# Altium schematic sheet Cell Monitor 8S RHS V0.1.SchDoc
size A4; SheetNumber: 5; SheetTotal: 9
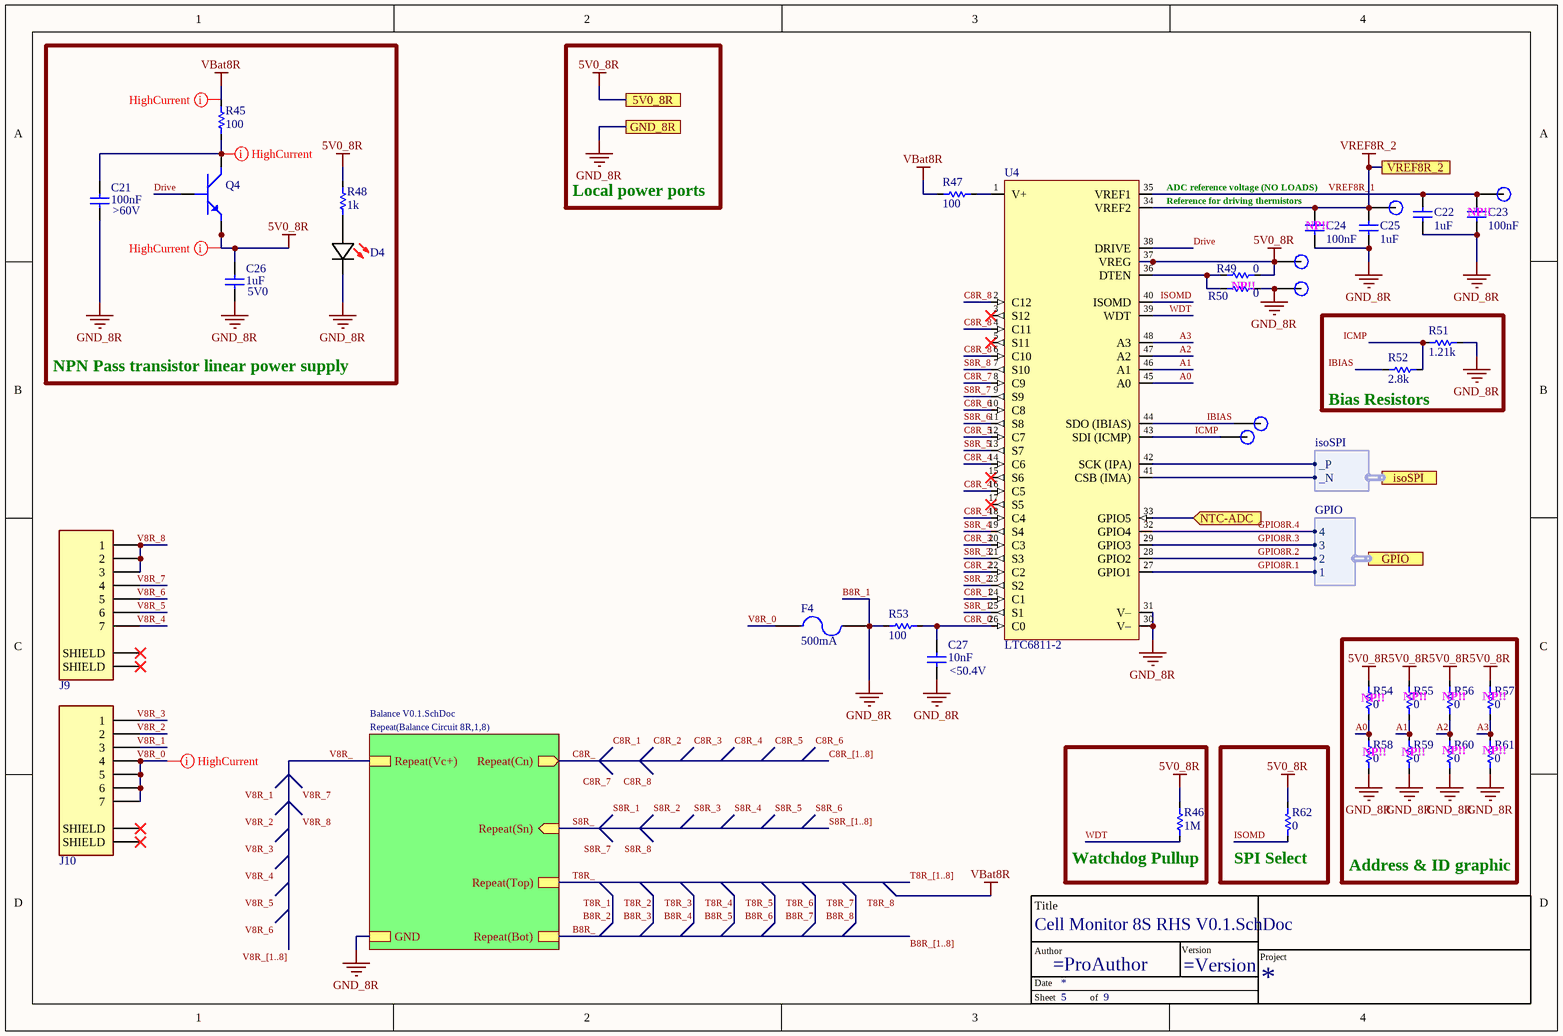
[diagram p0: Cell Monitor 8S RHS V0.1.SchDoc]

## Parts
*?  TitleBlock  (value not drawn)  (graphical)
C21  value 100nF  Voltage: >60V  [C_0402]  (hidden comment: GRM155R62A104KE14D)
C22  value 1uF  [C_0402]  (hidden comment: EMK105BJ105KV-F)
C23  value 100nF  [C_0402]  (hidden comment: GRM155R62A104KE14D)
C24  value 100nF  [C_0402]  (hidden comment: GRM155R62A104KE14D)
C25  value 1uF  [C_0402]  (hidden comment: EMK105BJ105KV-F)
C26  value 1uF  Voltage: 5V0  [C_0402]  (hidden comment: EMK105BJ105KV-F)
C27  value 10nF  Voltage: <50.4V  [C_0402]  (hidden comment: C1005X7S2A103K050BB)
D4  150060SS55040  [LED (0603)]  (value not drawn)
F4  Current Rating: 500mA  [0466.500NR]  (hidden comment: 0466.500NR)
J9  84953-7  [84953-7]  (value not drawn)
J10  84953-7  [84953-7]  (value not drawn)
NT5  NetTie  [NetTie]  (value not drawn)  (net tie, no BOM)
NT6  NetTie  [NetTie]  (value not drawn)  (net tie, no BOM)
Q4  PHPT60603NYX  [LFPAK56 (SOT669)]  (value not drawn)
R45  value 100  [R_2010]  (hidden comment: CRM2010-FX-1000ELF)
R46  value 1M  [R_0402]  (hidden comment: RC0402JR-071ML)
R47  value 100  [R_2010]  (hidden comment: CRM2010-FX-1000ELF)
R48  value 1k  [R_0402]  (hidden comment: RC0402FR-071KL)
R49  value 0  [R_0402]  (hidden comment: CR0402-J/-000GLF)
R50  value 0  [R_0402]  (hidden comment: CR0402-J/-000GLF)
R51  value 1.21k  [R_0402]  (hidden comment: CR0402-FX-1211GLF)
R52  value 2.8k  [R_0402]  (hidden comment: ERJ-2RKF2801X)
R53  value 100  [R_0402]  (hidden comment: RC0402FR-07100RL)
R54  value 0  [R_0402]  (hidden comment: CR0402-J/-000GLF)
R55  value 0  [R_0402]  (hidden comment: CR0402-J/-000GLF)
R56  value 0  [R_0402]  (hidden comment: CR0402-J/-000GLF)
R57  value 0  [R_0402]  (hidden comment: CR0402-J/-000GLF)
R58  value 0  [R_0402]  (hidden comment: CR0402-J/-000GLF)
R59  value 0  [R_0402]  (hidden comment: CR0402-J/-000GLF)
R60  value 0  [R_0402]  (hidden comment: CR0402-J/-000GLF)
R61  value 0  [R_0402]  (hidden comment: CR0402-J/-000GLF)
R62  value 0  [R_0402]  (hidden comment: CR0402-J/-000GLF)
TP15  VREF1  [Test Point]  (value not drawn)  (no BOM)
TP16  VREF2  [Test Point]  (value not drawn)  (no BOM)
TP17  5V0_8R  [Test Point]  (value not drawn)  (no BOM)
TP18  IBIAS  [Test Point]  (value not drawn)  (no BOM)
TP19  ICMP  [Test Point]  (value not drawn)  (no BOM)
TP20  5V0_8R  [Test Point]  (value not drawn)  (no BOM)
U4  LTC6811-2  [SSOP50P780X200-48N]

## Blocks framed on the sheet
NPN Pass transistor linear power supply: C21 C26 D4 Q4 R45 R48
Bias Resistors: R51 R52
Address & ID graphic: R54-R61
Watchdog Pullup: R46
SPI Select: R62

## Sub-sheets
Repeat(Balance Circuit 8R,1,8) = Balance V0.1.SchDoc: Repeat(Bot), Repeat(Vc+), Repeat(Top), Repeat(Cn) (out), Repeat(Sn) (in), GND

## Ports
5V0_8R, GND_8R, GPIO (harness GPIO), isoSPI (harness isoSPI), NTC-ADC (in), VREF8R_2

## Harnesses
GPIO: 1, 2, 3, 4
isoSPI: _P, _N

## Nets
5V0_8R: C26.2 Q4.1(Emitter) Q4.2(Emitter) Q4.3(Emitter) R46.2 R48.2 R49.2 R54.2 R55.2 R56.2 R57.2 R62.2 TP17.1 U4.37(VREG) ; port 5V0_8R
GND_8R: C21.1 C22.1 C23.1 C24.1 C25.1 C26.1 C27.1 D4.1(K) F4.2 NT5.1 R50.1 R51.2 R53.1 R58.1 R59.1 R60.1 R61.1 TP20.1 U4.30(V–) U4.31(V–) ; port GND_8R, sheet Repeat(Balance Circuit 8R,1,8)/GND
VBat8R: NT6.2 R45.2 R47.2
VREF8R_2: C24.2 C25.2 TP16.1 U4.34(VREF2) ; port VREF8R_2
A0: R54.1 R58.2 U4.45(A0)
A1: R55.1 R59.2 U4.46(A1)
A2: R56.1 R60.2 U4.47(A2)
A3: R57.1 R61.2 U4.48(A3)
B8R_: sheet Repeat(Balance Circuit 8R,1,8)/Repeat(Bot)
B8R_1: NT5.2
C8R_: sheet Repeat(Balance Circuit 8R,1,8)/Repeat(Cn)
C8R_0: C27.2 R53.2 U4.26(C0)
C8R_1: U4.24(C1)
C8R_2: U4.22(C2)
C8R_3: U4.20(C3)
C8R_4: U4.14(C6) U4.16(C5) U4.18(C4)
C8R_5: U4.12(C7)
C8R_6: U4.10(C8)
C8R_7: U4.8(C9)
C8R_8: U4.2(C12) U4.4(C11) U4.6(C10)
Drive: Q4.4(Base) U4.38(DRIVE)
GPIO8R.1: U4.27(GPIO1) ; port GPIO.1
GPIO8R.2: U4.28(GPIO2) ; port GPIO.2
GPIO8R.3: U4.29(GPIO3) ; port GPIO.3
GPIO8R.4: U4.32(GPIO4) ; port GPIO.4
IBIAS: R52.1 TP18.1 U4.44(SDO_(IBIAS))
ICMP: R51.1 R52.2 TP19.1 U4.43(SDI_(ICMP))
ISOMD: R62.1 U4.40(ISOMD)
NTC-ADC: U4.33(GPIO5) ; port NTC-ADC
S8R_: sheet Repeat(Balance Circuit 8R,1,8)/Repeat(Sn)
S8R_1: U4.25(S1)
S8R_2: U4.23(S2)
S8R_3: U4.21(S3)
S8R_4: U4.19(S4)
S8R_5: U4.13(S7)
S8R_6: U4.11(S8)
S8R_7: U4.9(S9)
S8R_8: U4.7(S10)
T8R_: sheet Repeat(Balance Circuit 8R,1,8)/Repeat(Top)
T8R_8: NT6.1
V8R_: sheet Repeat(Balance Circuit 8R,1,8)/Repeat(Vc+)
V8R_0: F4.1 J10.4 J10.5 J10.6 J10.7
V8R_1: J10.3
V8R_2: J10.2
V8R_3: J10.1
V8R_4: J9.7
V8R_5: J9.6
V8R_6: J9.5
V8R_7: J9.4
V8R_8: J9.1 J9.2 J9.3
VREF8R_1: C22.2 C23.2 TP15.1 U4.35(VREF1)
WDT: R46.1 U4.39(WDT)
NetC21_2: C21.2 Q4.5(Collector) R45.1
NetD4_2: D4.2(A) R48.1
NetR47_1: R47.1 U4.1(V+)
NetR49_1: R49.1 R50.2 U4.36(DTEN)
NetU4_41: U4.41(CSB_(IMA)) ; port isoSPI._N
NetU4_42: U4.42(SCK_(IPA)) ; port isoSPI._P

Not connected (* = marked no-connect by the designer): J9 S1(SHIELD)* S2(SHIELD)*; J10 S1(SHIELD)* S2(SHIELD)*; U4 3(S12)* 5(S11)* 15(S6)* 17(S5)*

## Buses and harness runs
bus B8R_[1..8]
bus C8R_[1..8]
bus S8R_[1..8]
bus T8R_[1..8]
bus V8R_[1..8]

## Layout directives
net class HighCurrent; Current: >50mA: 5V0_8R, NetC21_2, V8R_0, VBat8R

## Notes on the sheet
- Local power ports
- ADC reference voltage (NO LOADS)
- (near C24) Reference for driving thermistors
- (near C24) NP!!
- (near C23) NP!!
- (near R50) NP!!
- (near R54) NP!!
- (near R55) NP!!
- (near R56) NP!!
- (near R57) NP!!
- (near R58) NP!!
- (near R59) NP!!
- (near R60) NP!!
- (near R61) NP!!
- Labels drawn without touching a wire or pin: C8R_1, C8R_2, C8R_3, C8R_4, C8R_5, C8R_6, C8R_7, C8R_8, S8R_1, S8R_2, S8R_3, S8R_4, S8R_5, S8R_6, S8R_7, S8R_8, V8R_1, V8R_2, V8R_3, V8R_4, V8R_5, V8R_6, V8R_7, V8R_8
- (in symbol TitleBlock) Title; Author; Version; Project; Date; Sheet; of

## Library data of the parts
C21-C27 = Capacitor: ComponentLink1Description: New link; ComponentLink1URL: *
  C21 C23 C24: Manufacture Part Number 1: GRM155R62A104KE14D
D4 = 150060SS55040: LED RED DIFFUSED 0603 SMD; Manufacturer: Wurth Electronics; Lens Style: Flat; Luminous Intensity: 70mcd; Forward Voltage: 2V; Test Current: 20mA; Viewing Angle: 140°; Dominant Wavelength: 630nm; Lens Size: 0.8mm; Supplier 1: Mouser; Manufacturer Part Number: 150060SS55040; RoHS: No; Category: LEDs; Stock 1: 17006; Pricing 1: 1=0.18000, 10=0.16800, 50=0.16800, 100=0.15200, 1000=0.12100, 10000=0.10600 (USD); Mount: Surface Mount; Case/Package: 0603; Color: Red; Case Code (Imperial): 0603; Case Code (Metric): 1608; Packaging: Tape and Reel; Lens Transparency: Diffused; Length: 1.6mm; Width: 0.8mm; Height: 0.5mm; RoHS Compliant: No; Supplier Part Number 1: 710-150060SS55040
F4 = Fuse 2: LITTELFUSE - 0466.500NR - Fuse, Surface Mount, 500 mA, 466 Series, 63 VAC, 63 VDC, Very Fast Acting, 1206; Body Material: Thermoplastic; Voltage Rating (AC): 63V; Resistance: 350mR; DC Cold Resistance: 248mR; Fuse Type: Board Mount (Cartridge Style Excluded); Approvals: UL,CSA; Published: 8-Jun-2000; LatestRevisionDate: 17-Jul-2002; LatestRevisionNote: Re-released for DXP Platform.; PackageReference: PIN-W2/E2.8; Publisher: Altium Limited; PackageDescription: Thru-Hole; 2 Leads; Supplier 1: Mouser; Supplier Part Number 1: 576-0466.500NR; Manufacturer: Littelfuse; Manufacturer Part Number: 0466.500NR; RoHS: Yes; Category: Fuses; Stock 1: 36497; Pricing 1: 1=0.77000, 10=0.59200, 50=0.59200, 100=0.48900, 1000=0.41600, 10000=0.39000 (USD); Mount: Surface Mount; Case/Package: 1206; Number of Pins: 2; Case Code (Metric): 3216; Case Code (Imperial): 1206; Housing Material: Ceramic; Terminal Material: Copper; Min Operating Temperature: -55°C; Max Operating Temperature: 90°C; Packaging: Tape and Reel; Package Quantity: 5000; Voltage Rating (DC): 63V; Series: 466; Voltage Rating: 63V; Termination: SMD/SMT; Fuse Current: 500mA; Working Voltage: 63V; Length: 3.18mm; Width: 0.06inch; Height: 0.023inch; Depth: 1.52mm; Radiation Hardening: No; RoHS Compliant: Yes; REACH SVHC: Unknown; Lead Free: Lead Free; ComponentLink1URL: https://datasheet.ciiva.com/17081/0466-500nr-17081083.pdf?src-supplier=Allied+Electronics; ComponentLink1Description: https://datasheet.ciiva.com/17081/0466-500nr-17081083.pdf?src-supplier=Allied+Electronics; ComponentLink2URL: https://datasheet.ciiva.com/16327/littelfuse-fuse-466-16327478.pdf?src-supplier=Future+Electronics; ComponentLink2Description: https://datasheet.ciiva.com/16327/littelfuse-fuse-466-16327478.pdf?src-supplier=Future+Electronics; ComponentLink3URL: https://datasheet.ciiva.com/299/466seriesdrawing-299207.pdf?src-supplier=Digi-Key; ComponentLink3Description: https://datasheet.ciiva.com/299/466seriesdrawing-299207.pdf?src-supplier=Digi-Key; ComponentLink4URL: https://datasheet.ciiva.com/299/466seriesdrawing-299208.pdf?src-supplier=Digi-Key; ComponentLink4Description: https://datasheet.ciiva.com/299/466seriesdrawing-299208.pdf?src-supplier=Digi-Key; ComponentLink5URL: https://datasheet.ciiva.com/299/466seriesdrawing-299209.pdf?src-supplier=Digi-Key; ComponentLink5Description: https://datasheet.ciiva.com/299/466seriesdrawing-299209.pdf?src-supplier=Digi-Key; ComponentLink6URL: https://datasheet.ciiva.com/14102/ei466-dat-e-14102891.pdf?src-supplier=Distrelec; ComponentLink6Description: https://datasheet.ciiva.com/14102/ei466-dat-e-14102891.pdf?src-supplier=Distrelec; ComponentLink7URL: https://datasheet.ciiva.com/15186/getdatasheetpartid-57351-15186924.pdf?src-supplier=Verical; ComponentLink7Description: https://datasheet.ciiva.com/15186/getdatasheetpartid-57351-15186924.pdf?src-supplier=Verical
J9 J10 = 84953-7: FPC Connectors, Flex-to-Board, 7 Position, .039 in [1 mm] Centerline, Zero Insertion Force (ZIF), Right Angle, Surface Mount; Manufacturer: TE Connectivity; Current Rating: 1A; Number of Contacts: 7; Shielding: Unshielded; Gender: Female; Voltage Rating: 200V; Connector Type: Receptacle,Connector,Socket; Wire/Cable Type: Flat Flex; Mating Alignment: Yes (With); PCB Mount Alignment: No (Without); PCB Mount Retention: With; Contact Location: Top; Pitch: 0.039inch; Plating Thickness: 2um; Supplier 1: Mouser; Manufacturer Part Number: 84953-7; RoHS: Yes; Category: FFC / FPC; Pricing 1: 1=0.96000, 10=0.78800, 50=0.78800, 100=0.68800, 500=0.59100, 1000=0.52600, 1500=0.47600, 4500=0.45900, 9000=0.43600, 10000=0.43600, 24000=0.42600 (USD); Mount: Surface Mount; Contact Material: Bronze; Contact Plating: Tin,Bright; Housing Color: Natural; Housing Material: Polymer; Min Operating Temperature: -40°C; Max Operating Temperature: 85°C; Termination: SMD/SMT; Package Quantity: 1500; Number of Rows: 1; Packaging: Tape and Reel; Orientation: Right Angle; Number of Positions: 7; Connector System: Flex-to-Board; PCB Mounting Orientation: Right Angle; Sealable: No (Without); Shrouded: Yes (With); Contact Current Rating: 1A; Max Voltage Rating (AC): 200V; Series: FPC; Length: 0.5866inch; Width: 0.2575inch; Height: 2.56mm; Depth: 7.3mm; Radiation Hardening: No; ELV: Compliant; REACH SVHC: Unknown; Flammability Rating: UL94 V-0; RoHS Compliant: Yes; ComponentLink1URL: https://datasheet.ciiva.com/669/eng-cd-84953-a3-669227.pdf?src-supplier=Digi-Key; ComponentLink1Description: https://datasheet.ciiva.com/669/eng-cd-84953-a3-669227.pdf?src-supplier=Digi-Key; ComponentLink2URL: https://datasheet.ciiva.com/669/eng-cd-84953-a3-669228.pdf?src-supplier=Digi-Key; ComponentLink2Description: https://datasheet.ciiva.com/669/eng-cd-84953-a3-669228.pdf?src-supplier=Digi-Key; ComponentLink3URL: https://datasheet.ciiva.com/30243/eng-ds-1-1773440-6-0506-30243340.pdf?src-supplier=Onlinecomponents.com; ComponentLink3Description: https://datasheet.ciiva.com/30243/eng-ds-1-1773440-6-0506-30243340.pdf?src-supplier=Onlinecomponents.com; ComponentLink4URL: https://datasheet.ciiva.com/16659/eng-ds-1-1773440-6-0506-16659033.pdf?src-supplier=Avnet+Europe; ComponentLink4Description: https://datasheet.ciiva.com/16659/eng-ds-1-1773440-6-0506-16659033.pdf?src-supplier=Avnet+Europe; ComponentLink5URL: https://datasheet.ciiva.com/669/eng-cd-84953-a3-669226.pdf?src-supplier=Digi-Key; ComponentLink5Description: https://datasheet.ciiva.com/669/eng-cd-84953-a3-669226.pdf?src-supplier=Digi-Key; ComponentLink6URL: https://datasheet.ciiva.com/15177/getdatasheetpartid-565061-15177031.pdf?src-supplier=Verical; ComponentLink6Description: https://datasheet.ciiva.com/15177/getdatasheetpartid-565061-15177031.pdf?src-supplier=Verical; ComponentLink7URL: https://datasheet.ciiva.com/10034/eng-ds-1-1773440-6-0506-10034350.pdf?src-supplier=Avnet; ComponentLink7Description: https://datasheet.ciiva.com/10034/eng-ds-1-1773440-6-0506-10034350.pdf?src-supplier=Avnet; Supplier Part Number 1: 571-84953-7
Q4 = PHPT60603NYX: 60V, 3 A NPN high power bipolar transistor
R45-R62 = Resistor
TP15-TP20 = Test Point: 1.2mm Test point
U4 = LTC6811-2: 12 Channel Multicell Battery Monitor with Addressable Interface